# Altium schematic sheet OutputConnectors.SchDoc
size Tabloid; DocumentNumber: 8; SheetNumber: 8; SheetTotal: 11; SheetName: Audio output connectors; Size: 11x17; Sheet_Name: OutputConnectos
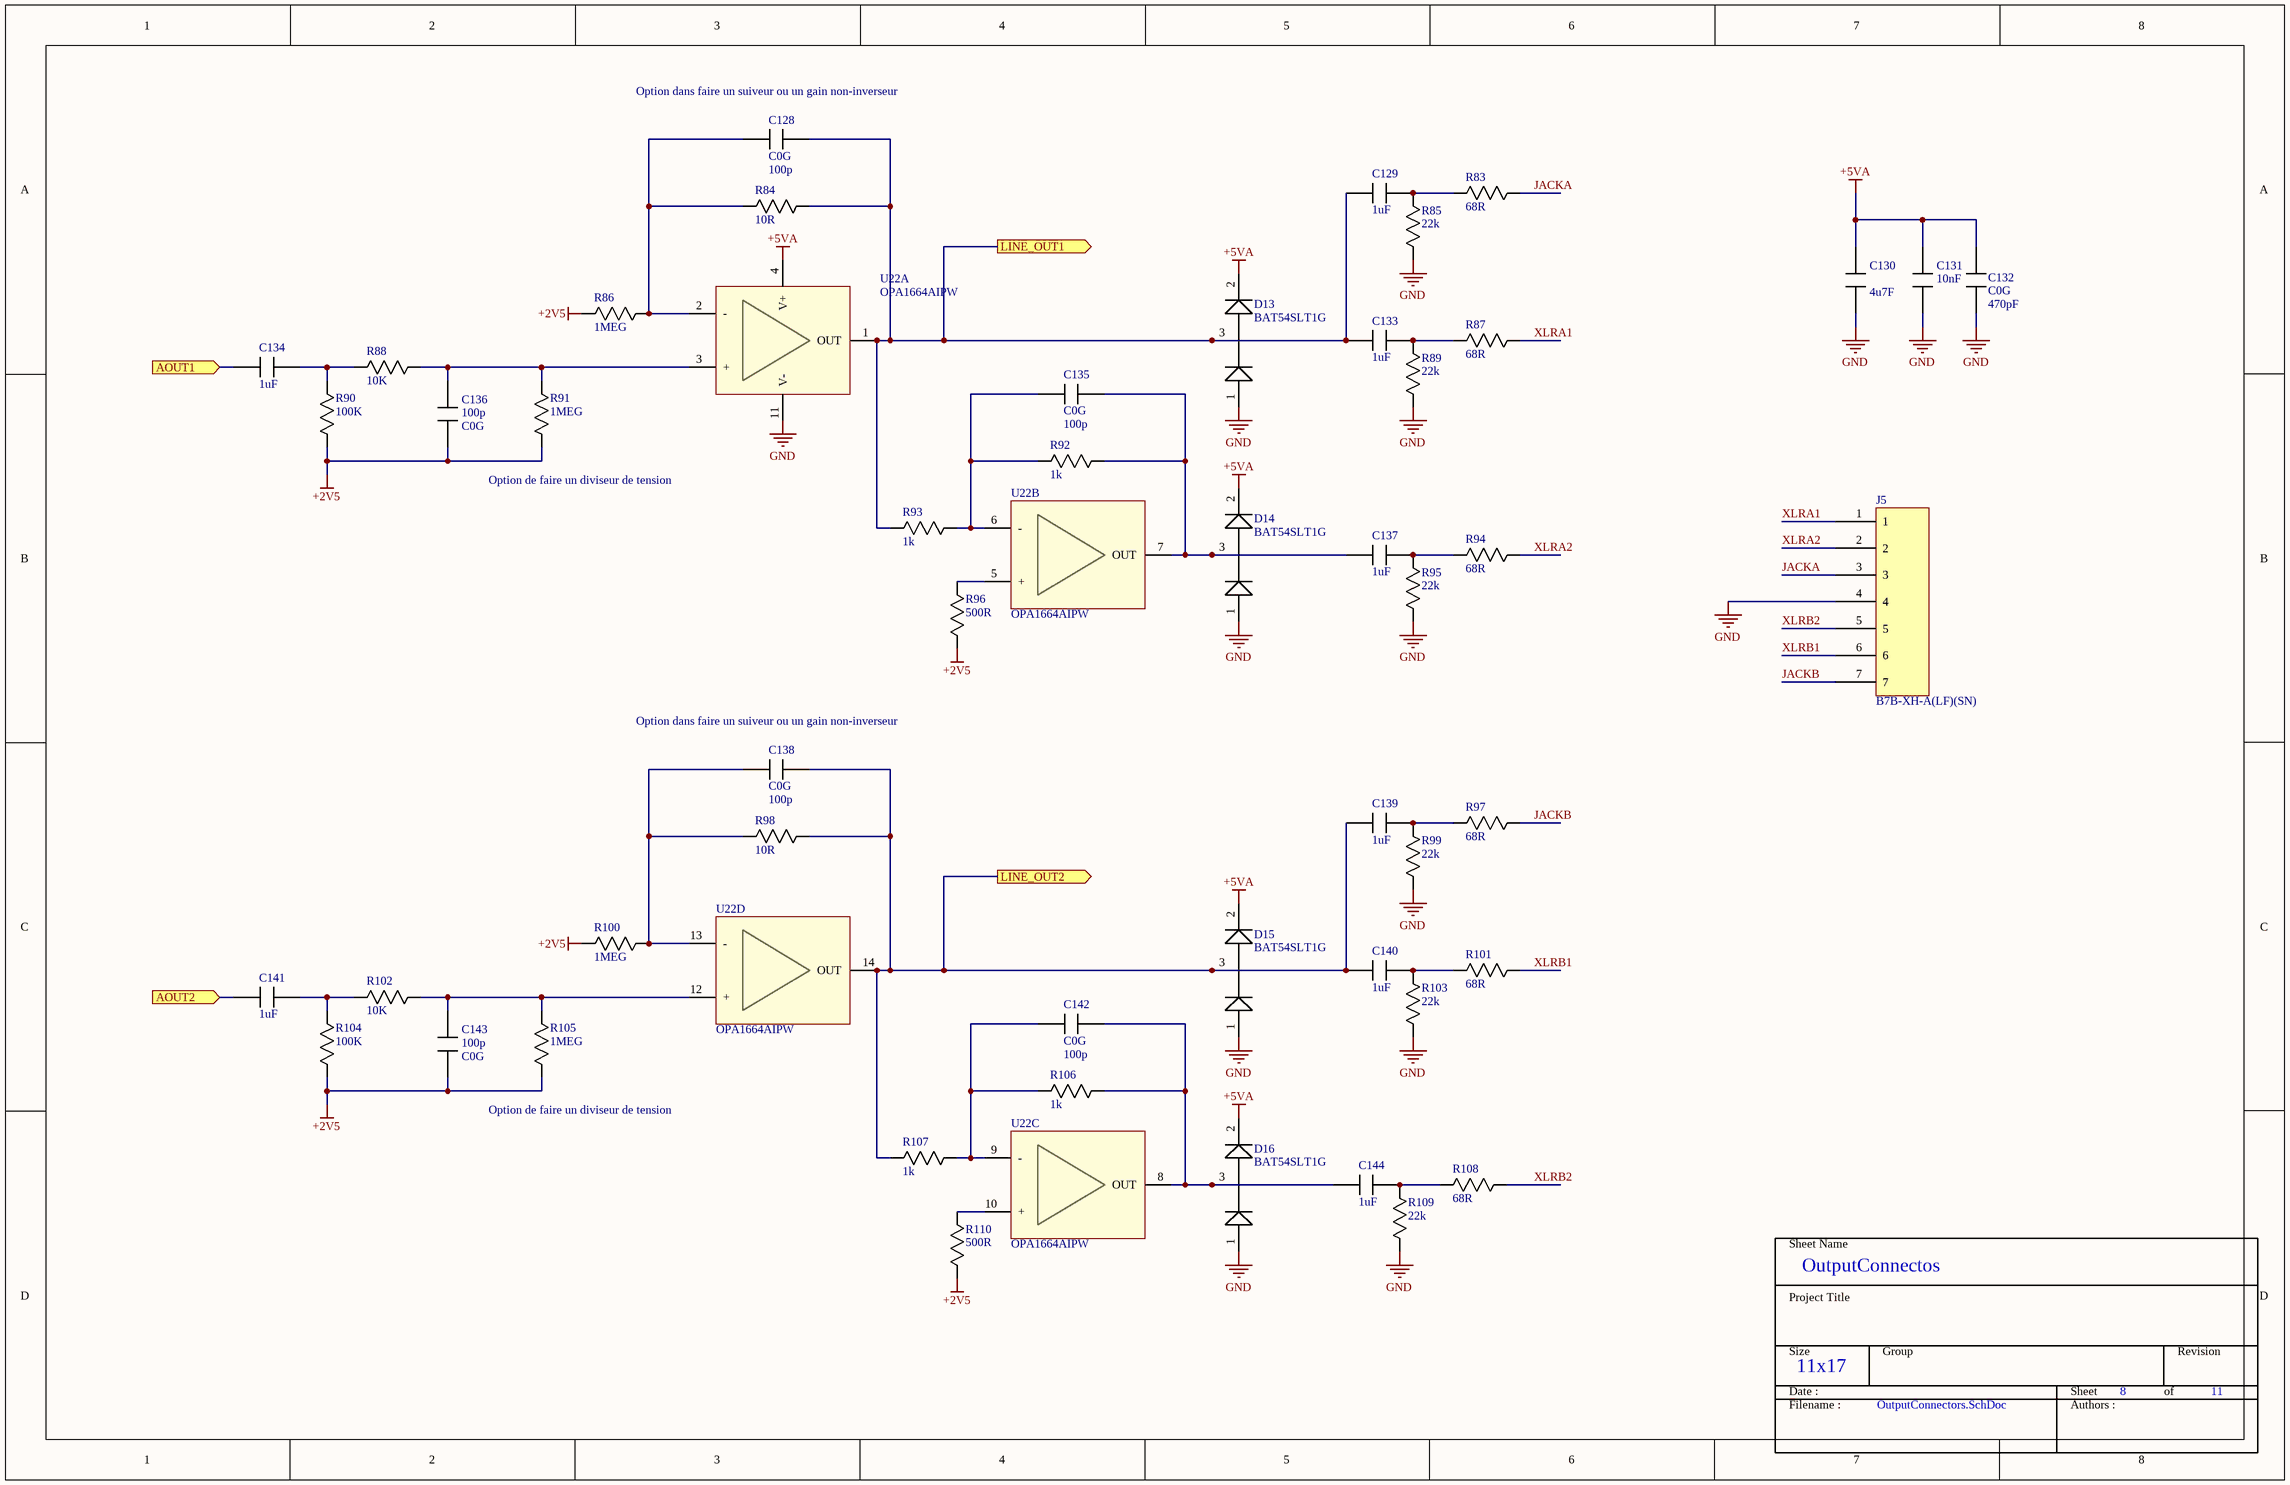
[diagram p0: OutputConnectors.SchDoc]

## Parts
C128  value 100p  Type: C0G  [0402]  (hidden comment: Capacitor)
C129  value 1uF  [0402]  (hidden comment: Capacitor)
C130  value 4u7F  [0805]  (hidden comment: Capacitor)
C131  value 10nF  [0603]  (hidden comment: Capacitor)
C132  value 470pF  Type: C0G  [0603]  (hidden comment: Capacitor)
C133  value 1uF  [0402]  (hidden comment: Capacitor)
C134  value 1uF  [0402]  (hidden comment: Capacitor)
C135  value 100p  Type: C0G  [0402]  (hidden comment: Capacitor)
C136  value 100p  Type: C0G  [0402]  (hidden comment: Capacitor)
C137  value 1uF  [0402]  (hidden comment: Capacitor)
C138  value 100p  Type: C0G  [0402]  (hidden comment: Capacitor)
C139  value 1uF  [0402]  (hidden comment: Capacitor)
C140  value 1uF  [0402]  (hidden comment: Capacitor)
C141  value 1uF  [0402]  (hidden comment: Capacitor)
C142  value 100p  Type: C0G  [0402]  (hidden comment: Capacitor)
C143  value 100p  Type: C0G  [0402]  (hidden comment: Capacitor)
C144  value 1uF  [0402]  (hidden comment: Capacitor)
D13  Mfg_PN: BAT54SLT1G  [SOT23_132]  (hidden comment: Diode_dual)
D14  Mfg_PN: BAT54SLT1G  [SOT23_132]  (hidden comment: Diode_dual)
D15  Mfg_PN: BAT54SLT1G  [SOT23_132]  (hidden comment: Diode_dual)
D16  Mfg_PN: BAT54SLT1G  [SOT23_132]  (hidden comment: Diode_dual)
J5  B7B-XH-A(LF)(SN)  [CONN_7_HEADER]
R83  value 68R  [0402]  (hidden comment: Resistor)
R84  value 10R  [0402]  (hidden comment: Resistor)
R85  value 22k  [0402]  (hidden comment: Resistor)
R86  value 1MEG  [0402]  (hidden comment: Resistor)
R87  value 68R  [0402]  (hidden comment: Resistor)
R88  value 10K  [0402]  (hidden comment: Resistor)
R89  value 22k  [0402]  (hidden comment: Resistor)
R90  value 100K  [0402]  (hidden comment: Resistor)
R91  value 1MEG  [0402]  (hidden comment: Resistor)
R92  value 1k  [0402]  (hidden comment: Resistor)
R93  value 1k  [0402]  (hidden comment: Resistor)
R94  value 68R  [0402]  (hidden comment: Resistor)
R95  value 22k  [0402]  (hidden comment: Resistor)
R96  value 500R  [0402]  (hidden comment: Resistor)
R97  value 68R  [0402]  (hidden comment: Resistor)
R98  value 10R  [0402]  (hidden comment: Resistor)
R99  value 22k  [0402]  (hidden comment: Resistor)
R100  value 1MEG  [0402]  (hidden comment: Resistor)
R101  value 68R  [0402]  (hidden comment: Resistor)
R102  value 10K  [0402]  (hidden comment: Resistor)
R103  value 22k  [0402]  (hidden comment: Resistor)
R104  value 100K  [0402]  (hidden comment: Resistor)
R105  value 1MEG  [0402]  (hidden comment: Resistor)
R106  value 1k  [0402]  (hidden comment: Resistor)
R107  value 1k  [0402]  (hidden comment: Resistor)
R108  value 68R  [0402]  (hidden comment: Resistor)
R109  value 22k  [0402]  (hidden comment: Resistor)
R110  value 500R  [0402]  (hidden comment: Resistor)
U22  Mfg_PN: OPA1664AIPW  [14-TSSOP]  (hidden comment: OPA1664)  (parts A,B,C,D of 4)

## Ports
AOUT1 (in), AOUT2 (in), LINE_OUT1 (out), LINE_OUT2 (out)

## Nets
+2V5: C136.2 C143.2 R86.2 R90.1 R91.1 R96.2 R100.2 R104.1 R105.1 R110.2
+5VA: C130.1 C131.1 C132.2 D13.2(K) D14.2(K) D15.2(K) D16.2(K) U22.4(V+)
GND: C130.2 C131.2 C132.1 D13.1(K) D14.1(K) D15.1(K) D16.1(K) J5.4 R85.1 R89.1 R95.1 R99.1 R103.1 R109.1 U22.11(V-)
AOUT1: C134.1 ; port AOUT1
AOUT2: C141.1 ; port AOUT2
JACKA: J5.3 R83.1
JACKB: J5.7 R97.1
LINE_OUT1: C128.2 C129.1 C133.1 D13.3(AK) R84.1 R93.2 U22.1(OUT) ; port LINE_OUT1
LINE_OUT2: C138.2 C139.1 C140.1 D15.3(AK) R98.1 R107.2 U22.14(OUT) ; port LINE_OUT2
XLRA1: J5.1 R87.1
XLRA2: J5.2 R94.1
XLRB1: J5.6 R101.1
XLRB2: J5.5 R108.1
NetC128_1: C128.1 R84.2 R86.1 U22.2(-)
NetC129_2: C129.2 R83.2 R85.2
NetC133_2: C133.2 R87.2 R89.2
NetC134_2: C134.2 R88.1 R90.2
NetC135_1: C135.1 R92.2 R93.1 U22.6(-)
NetC135_2: C135.2 C137.1 D14.3(AK) R92.1 U22.7(OUT)
NetC136_1: C136.1 R88.2 R91.2 U22.3(+)
NetC137_2: C137.2 R94.2 R95.2
NetC138_1: C138.1 R98.2 R100.1 U22.13(-)
NetC139_2: C139.2 R97.2 R99.2
NetC140_2: C140.2 R101.2 R103.2
NetC141_2: C141.2 R102.1 R104.2
NetC142_1: C142.1 R106.2 R107.1 U22.9(-)
NetC142_2: C142.2 C144.1 D16.3(AK) R106.1 U22.8(OUT)
NetC143_1: C143.1 R102.2 R105.2 U22.12(+)
NetC144_2: C144.2 R108.2 R109.2
NetR96_1: R96.1 U22.5(+)
NetR110_1: R110.1 U22.10(+)

## Notes on the sheet
- (near C128) Option dans faire un suiveur ou un gain non-inverseur
- (near R91) Option de faire un diviseur de tension
- (near C138) Option dans faire un suiveur ou un gain non-inverseur
- (near R105) Option de faire un diviseur de tension
- Sheet Name
- Project Title
- Size
- Group
- Revision
- Date :
- Filename :
- Sheet
- Authors :
- of

## Library data of the parts
C128 C135 C136 C138 C142 C143 = Capacitor: Mfg: Yageo; Mfg_PN: CC0402JRNPO9BN101; HelpURL: *; NI: *; Supplier1: Digikey; Supplier1_PN: 311-1024-1-ND; Tolerance: *; Rating: *
C129 C133 C134 C137 C139-C141 C144 = Capacitor: Mfg: Samsung Electro-Mechanics; Mfg_PN: CL05A105MP5NNNC; HelpURL: *; NI: *; Supplier1: Digikey; Supplier1_PN: 1276-1448-1-ND; Tolerance: *; Type: *; Rating: *
C130 = Capacitor: Mfg: Samsung; Mfg_PN: CL21A475KAQNNNG; HelpURL: *; NI: *; Supplier1: Digikey; Supplier1_PN: 1276-6462-1-ND; Tolerance: *; Type: *; Rating: *
C131 = Capacitor: Mfg: Murata; Mfg_PN: CL05B103KO5NNNC; HelpURL: *; NI: *; Supplier1: Digikey; Supplier1_PN: 1276-1051-1-ND; Tolerance: *; Type: *; Rating: *
C132 = Capacitor: Mfg: Samsung; Mfg_PN: CL10C471JB8NCNC; HelpURL: *; NI: *; Supplier1: Digikey; Supplier1_PN: 1276-2302-1-ND; Tolerance: *; Rating: *
D13-D16 = Diode_dual: Diode; Mfg: Onsemi; HelpURL: *; NI: *; Supplier1: Digikey; Supplier1_PN: BAT54SLT1GOSCT-ND; Tolerance: *; Type: *; Rating: *; Value: *
J5 = CON_XH_JST_7pins: Mfg: JST Sales America Inc.; Supplier1: Digikey; Mfg_PN: B7B-XH-A(LF)(SN)
R83-R87 R89-R101 R103-R110 = Resistor: Mfg: Yageo; Mfg_PN: 311-10GRCT-ND; HelpURL: *; NI: *; Supplier1: Digikey; Supplier1_PN: 311-100KGRCT-ND; Type: *; Rating: *; Tolerance: *
R88 R102 = Resistor: Mfg: Yageo; Mfg_PN: RC0603JR-07470RL; HelpURL: *; NI: *; Supplier1: Digikey; Supplier1_PN: 311-470GRCT-ND; Type: *; Rating: *; Tolerance: *
U22 = OPA1664: Quad amplifier (audio); Mfg: Texas Instruments; HelpURL: *; NI: *; Rating: *; Supplier1: Digikey; Supplier1_PN: 296-34981-ND; Tolerance: *; Value: *